# Altium schematic sheet 04_HDMI_Interface.SchDoc
size A3
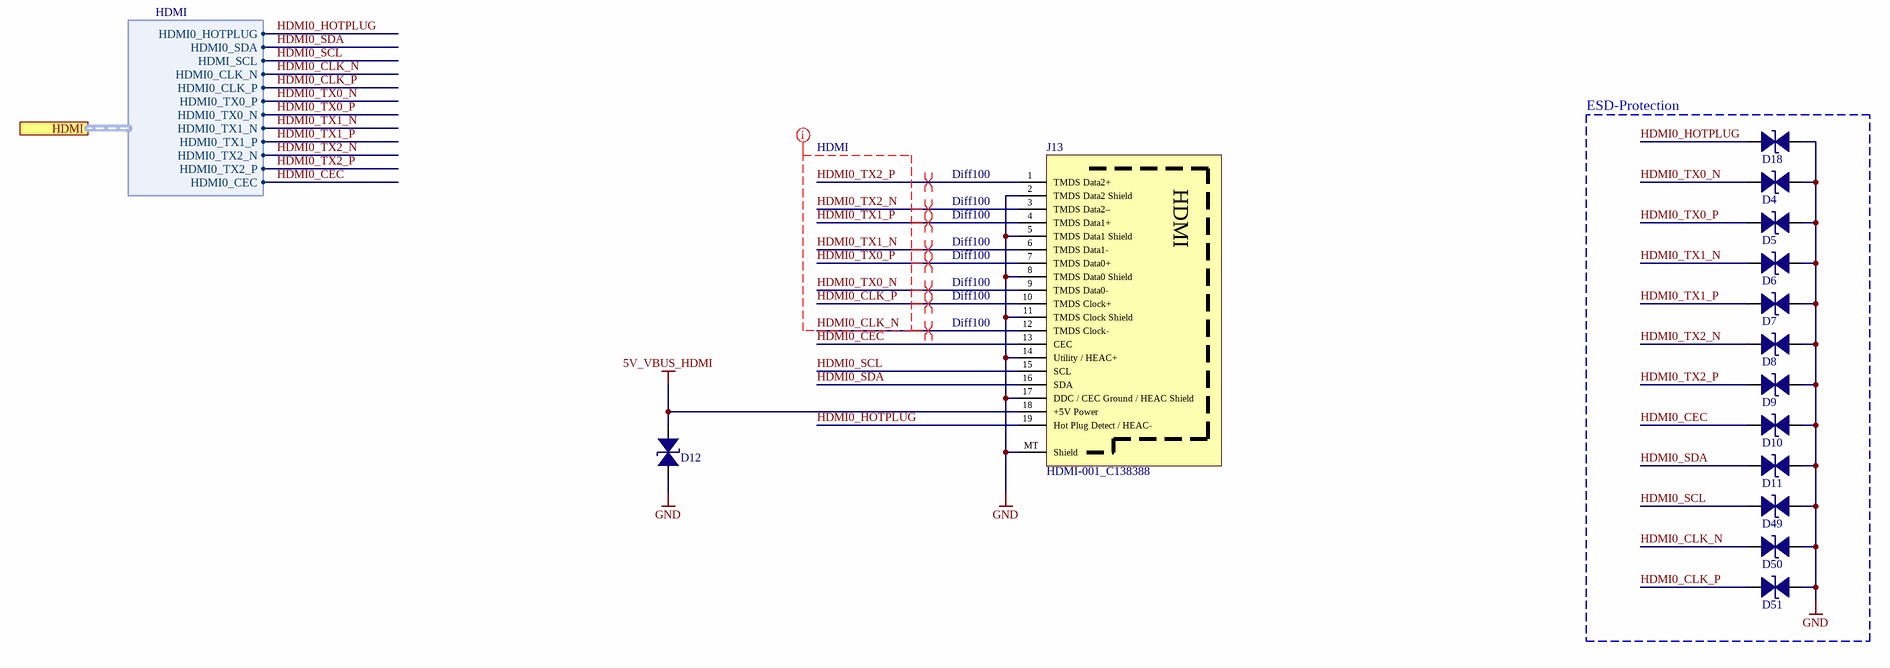
[diagram p0: 04_HDMI_Interface.SchDoc]

## Parts
D4  CESDP0402UC5VB  [TVS_0402]  (value not drawn)
D5  CESDP0402UC5VB  [TVS_0402]  (value not drawn)
D6  CESDP0402UC5VB  [TVS_0402]  (value not drawn)
D7  CESDP0402UC5VB  [TVS_0402]  (value not drawn)
D8  CESDP0402UC5VB  [TVS_0402]  (value not drawn)
D9  CESDP0402UC5VB  [TVS_0402]  (value not drawn)
D10  CESDP0402UC5VB  [TVS_0402]  (value not drawn)
D11  CESDP0402UC5VB  [TVS_0402]  (value not drawn)
D12  CESDP0402UC5VB  [TVS_0402]  (value not drawn)
D18  CESDP0402UC5VB  [TVS_0402]  (value not drawn)
D49  CESDP0402UC5VB  [TVS_0402]  (value not drawn)
D50  CESDP0402UC5VB  [TVS_0402]  (value not drawn)
D51  CESDP0402UC5VB  [TVS_0402]  (value not drawn)
J13  HDMI-001_C138388  [BOOMELE HDMI-001]

## Blocks framed on the sheet
ESD-Protection: D4-D11 D18 D49-D51

## Ports
HDMI (harness HDMI)

## Harnesses
HDMI: HDMI0_HOTPLUG, HDMI0_SDA, HDMI_SCL, HDMI0_CLK_N, HDMI0_CLK_P, HDMI0_TX0_P, HDMI0_TX0_N, HDMI0_TX1_N, HDMI0_TX1_P, HDMI0_TX2_N, HDMI0_TX2_P, HDMI0_CEC

## Nets
5V_VBUS_HDMI: D12.2 J13.18(+5V_Power)
GND: D4.2 D5.2 D6.2 D7.2 D8.2 D9.2 D10.2 D11.2 D12.1 D18.2 D49.2 D50.2 D51.2 J13.2(TMDS_Data2_Shield) J13.5(TMDS_Data1_Shield) J13.8(TMDS_Data0_Shield) J13.11(TMDS_Clock_Shield) J13.14(Utility_/_HEAC+) J13.17(DDC_/_CEC_Ground_/_HEAC_Shield) J13.MT(Shield)
HDMI0_CEC: D10.1 J13.13(CEC) ; port HDMI.HDMI0_CEC
HDMI0_CLK_N: D50.1 J13.12(TMDS_Clock-) ; port HDMI.HDMI0_CLK_N
HDMI0_CLK_P: D51.1 J13.10(TMDS_Clock+) ; port HDMI.HDMI0_CLK_P
HDMI0_HOTPLUG: D18.1 J13.19(Hot_Plug_Detect_/_HEAC-) ; port HDMI.HDMI0_HOTPLUG
HDMI0_SCL: D49.1 J13.15(SCL) ; port HDMI.HDMI_SCL
HDMI0_SDA: D11.1 J13.16(SDA) ; port HDMI.HDMI0_SDA
HDMI0_TX0_N: D4.1 J13.9(TMDS_Data0-) ; port HDMI.HDMI0_TX0_P
HDMI0_TX0_P: D5.1 J13.7(TMDS_Data0+) ; port HDMI.HDMI0_TX0_N
HDMI0_TX1_N: D6.1 J13.6(TMDS_Data1-) ; port HDMI.HDMI0_TX1_N
HDMI0_TX1_P: D7.1 J13.4(TMDS_Data1+) ; port HDMI.HDMI0_TX1_P
HDMI0_TX2_N: D8.1 J13.3(TMDS_Data2–) ; port HDMI.HDMI0_TX2_N
HDMI0_TX2_P: D9.1 J13.1(TMDS_Data2+) ; port HDMI.HDMI0_TX2_P

## Layout directives
differential pair; net class Diff100: HDMI0_CLK_N, HDMI0_CLK_P, HDMI0_TX0_N, HDMI0_TX0_P, HDMI0_TX1_N, HDMI0_TX1_P, HDMI0_TX2_N, HDMI0_TX2_P
net class HDMI: HDMI0_CLK_N, HDMI0_CLK_P, HDMI0_TX0_N, HDMI0_TX0_P, HDMI0_TX1_N, HDMI0_TX1_P, HDMI0_TX2_N, HDMI0_TX2_P

## Notes on the sheet
- Title:
- ++CONFIDENTIAL++
- Date:
- Sheet:
- /
- Time:
- Engineer
- Elektronik- und Softwareentwicklung aus Nürnberg
- The  information  contained  in  these  documents  is  confidential,  privileged  and  only  for  the
  information of the intended recipient and may
  not be used, published or redistributed without
  the prior written consent from PCB Arts GmbH.
- Revision:
- Checked:
- https://pcb-arts.com/
- mail@pcb-arts.com
- (in symbol HDMI-001_HDMI Connector 19Pin SMD) HDMI

## Library data of the parts
D4-D12 D18 D49-D51 = CESDP0402UC5VB_TVS Diode 0402: Low Capacitance ESD Protection Diode 0402; Manufacturer 1: CREATEK; Manufacturer 2 Prt. Nr.: BPESD0402-05ST; Manufacturer 1 Prt. Nr.: CESDP0402UC5VB; Manufacturer 2: BORN
J13 = HDMI-001_HDMI Connector 19Pin SMD: HDMI Connector Female 19 Pin LCSC C138388; Manufacturer 1: BOOMELE(Boom Precision Elec); Manufacturer 1 Prt. Nr.: HDMI-001